# EAGLE design Tastendruckverlaengerer_1 (EAGLE 9.6.2)
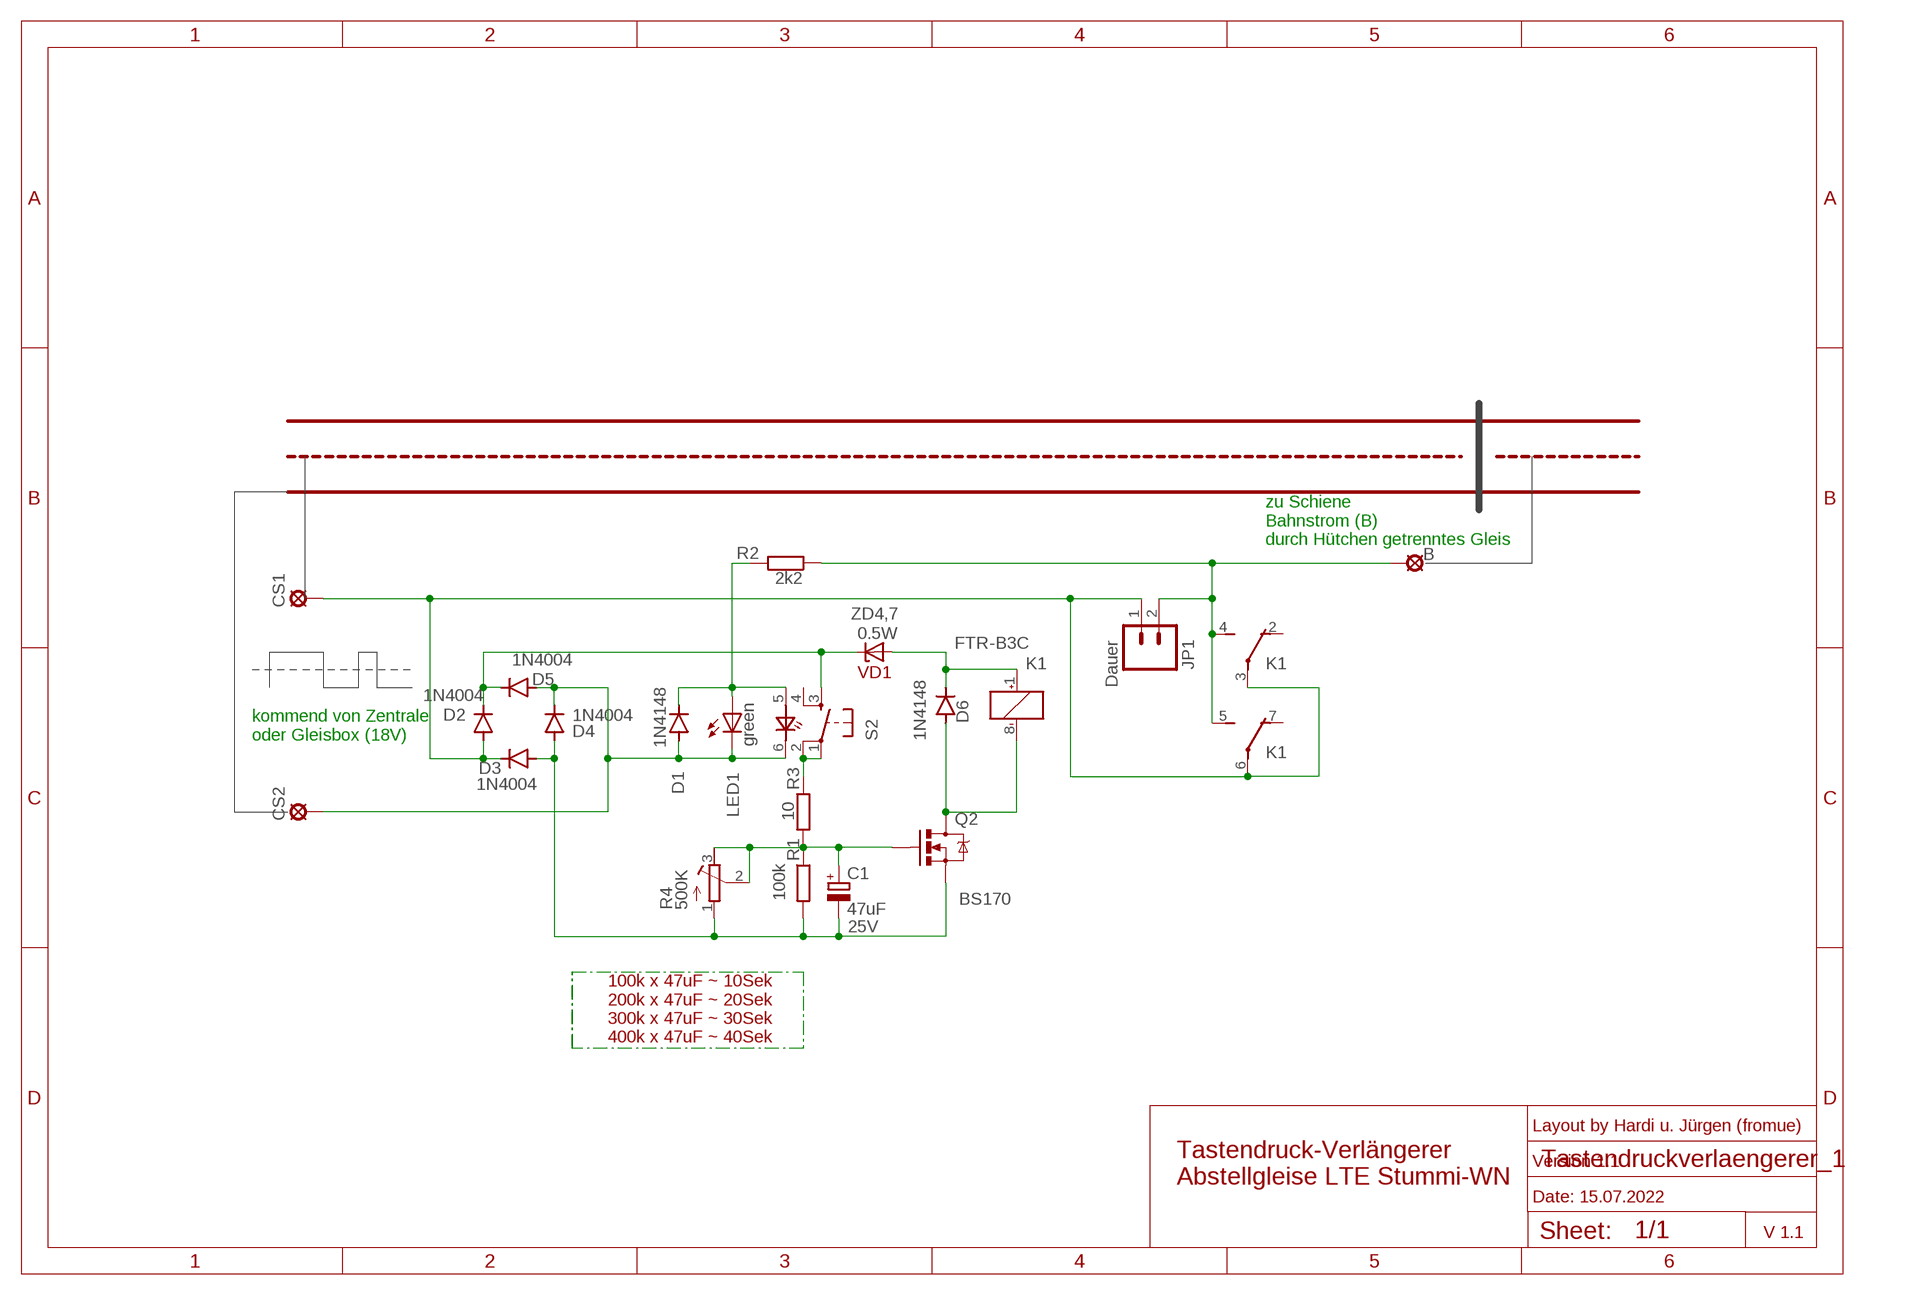
[diagram p0: schematic, sheet 1]

## Parts
B  SE14  [SE14]
C1  47uF  CPOL-EUTT2D5L  [TT2D5L]
CS1  SE14  [SE14]
CS2  SE14  [SE14]
D1  1N4148  1N4148DO35-7  [DO35-7]
D2  1N4004  1N4004DO41-10A  [DO41-10A]
D3  1N4004  1N4004DO41-10A  [DO41-10A]
D4  1N4004  1N4004DO41-10A  [DO41-10A]
D5  1N4004  1N4004DO41-10A  [DO41-10A]
D6  1N4148  1N4148DO35-7  [DO35-7]
JP1  Dauer  M02PTH  [1X02]
K1  FTR-B3C  [FTR-B4C]
LED1  green  LED3MM  [LED3MM]
Q2  BS170  MOSFET-NCHANNELBS170  [TO-92]
R1  100k  R0204/7  [0204/7]
R2  2k2  R0204/7  [0204/7]
R3  10  R0204/7  [0204/7]
R4  500K  R-TRIMM3296W  [RTRIM3296W]
S2  TASTER_LEDTC-1198-B  [TASTER_LED]
VD1  ZD4,7  DIODES-ZENER_5.6V(1N5232)  [DIODES-ZENER_DO35-7]

## Nets
N$3: CS1.MP D2.A D3.C JP1.1 K1.3(-1:P) K1.6(-2:P)
N$4: C1.- D3.A D4.A Q2.3(S) R1.2 R4.1(A)
N$5: D6.C K1.1(K:+) VD1.A
N$6: C1.+ Q2.2(G) R1.1 R3.2 R4.2(S) R4.3(E)
N$7: D6.A K1.8(K:-) Q2.1(D)
N$8: D1.C LED1.A R2.2 S2.5(+)
N$9: CS2.MP D1.A D4.C D5.A LED1.K(C) S2.6(-)
N$12: D2.C D5.C S2.3(S) VD1.C
N$13: B.MP JP1.2 K1.4(-1:S) K1.5(-2:S) R2.1
TAST: R3.1 S2.1(P) S2.2(P1)
Unconnected: K1.2(-1:O) K1.7(-2:O) S2.4(S1)

## Notes on the sheet
- zu Schiene 
  Bahnstrom (B)
  durch Hütchen getrenntes Gleis
- kommend von Zentrale
  oder Gleisbox (18V)
- 100k x 47uF ~ 10Sek
  200k x 47uF ~ 20Sek
  300k x 47uF ~ 30Sek
  400k x 47uF ~ 40Sek
- Layout by Hardi u. Jürgen (fromue)
- Version 1.1
- Tastendruck-Verlängerer
  Abstellgleise LTE Stummi-WN
- Date: 15.07.2022
- V 1.1

## Library data of the parts
B CS1 CS2 = solpad:SE14: SOLDER PAD E1553, drill 1,4mm, distributor Buerklin, 07F820
C1 = resistor:CPOL-EU: POLARIZED CAPACITOR, European symbol; ADD: 25V
D1 D6 = diode:1N4148: DIODE high speed (Philips); SPICEPREFIX: D
D2-D5 = diode:1N4004: DIODE general purpose rectifier, 1 A
JP1 = SparkFun-Connectors:M02: Standard 2-pin 0.1" header. Use with - straight break away headers ( PRT-00116) - right angle break away headers (PRT-00553) - swiss pins (PRT-00743) - machine pins (PRT-00117) - female headers (PRT-00115) Molex polarized connector foot print use with: PRT-08233 with associated crimp pins and housings. 2.54_SCREWTERM for use with PRT-10571. 3.5mm Screw Terminal footprints for PRT-08084 5mm Screw Terminal footprints for use with PRT-08432
K1 = relay:FTR-B3: ULTRA MINIATURE RELAY 2 POLES - 2 A (Slim Profile Signal Relay) FUJITSU FTR-B4 SERIES Source: FTR-B4.pdf
LED1 = Arduino_fuer_LEDs_DCC_2:LED: LED OSRAM: - CHIPLED LG R971, LG N971, LY N971, LG Q971, LY Q971, LO R971, LY R971 LH N974, LH R974 LS Q976, LO Q976, LY Q976 LO Q996 - Hyper CHIPLED LW Q18S LB Q993, LB Q99A, LB R99A - SideLED LS A670, LO A670, LY A670, LG A670, LP A670 LB A673, LV A673, LT A673, LW A673 LH A674 LY A675 LS A676, LA A676, LO A676, LY A676, LW A676 LS A679, LY A679, LG A679 - Hyper Micro SIDELED® LS Y876, LA Y876, LO Y876, LY Y876 LT Y87S - SmartLED LW L88C, LW L88S LB L89C, LB L89S, LG L890 LS L89K, LO L89K, LY L89K LS L896, LA L896, LO L896, LY L896 - TOPLED LS T670, LO T670, LY T670, LG T670, LP T670 LSG T670, LSP T670, LSY T670, LOP T670, LYG T670 LG T671, LOG T671, LSG T671 LB T673, LV T673, LT T673, LW T673 LH T674 LS T676, LA T676, LO T676, LY T676, LB T676, LH T676, LSB T676, LW T676 LB T67C, LV T67C, LT T67C, LS T67K, LO T67K, LY T67K, LW E67C LS E67B, LA E67B, LO E67B, LY E67B, LB E67C, LV E67C, LT E67C LW T67C LS T679, LY T679, LG T679 LS T770, LO T770, LY T770, LG T770, LP T770 LB T773, LV T773, LT T773, LW T773 LH T774 LS E675, LA E675, LY E675, LS T675 LS T776, LA T776, LO T776, LY T776, LB T776 LHGB T686 LT T68C, LB T68C - Hyper Mini TOPLED® LB M676 - Mini TOPLED Santana® LG M470 LS M47K, LO M47K, LY M47K Source: http://www.osram.convergy.de LUXEON: - LUMILED® LXK2-PW12-R00, LXK2-PW12-S00, LXK2-PW14-U00, LXK2-PW14-V00 LXK2-PM12-R00, LXK2-PM12-S00, LXK2-PM14-U00 LXK2-PE12-Q00, LXK2-PE12-R00, LXK2-PE12-S00, LXK2-PE14-T00, LXK2-PE14-U00 LXK2-PB12-K00, LXK2-PB12-L00, LXK2-PB12-M00, LXK2-PB14-N00, LXK2-PB14-P00, LXK2-PB14-Q00 LXK2-PR12-L00, LXK2-PR12-M00, LXK2-PR14-Q00, LXK2-PR14-R00 LXK2-PD12-Q00, LXK2-PD12-R00, LXK2-PD12-S00 LXK2-PH12-R00, LXK2-PH12-S00 LXK2-PL12-P00, LXK2-PL12-Q00, LXK2-PL12-R00 Source: www.luxeon.com KINGBRIGHT: KA-3528ASYC Source: www.kingbright.com
Q2 = SparkFun-DiscreteSemi:MOSFET-NCHANNEL: Common NMOSFET Parts MFG P/N Store ID Prod ID FDD8780 TRANS-09984 SI7820DN TRANS-11055 FDS6630A IC-08089 2N7002PW TRANS-11151 FQP30N06L COM-10213 TRANS-10060 BSS123LT1G TRANS-08345 BSS138 TRANS-00830 BS170 2N7000
R1 R3 = Arduino_fuer_LEDs_DCC_2:R: RESISTOR, European symbol; SPICEMODEL: NONE; SPICEPREFIX: R
R2 = Arduino_fuer_LEDs_DCC_2:R: RESISTOR, European symbol; SPICEMODEL: NONE; SPICEPREFIX: 4k7
R4 = resistor:R-TRIMM: Trimm resistor
S2 = switch-omron:TASTER_LED: OMRON SWITCH; ALI: https://de.aliexpress.com/item/4000415375387.html; ELV: 091576 EAN 4023392915765
VD1 = Z-Diode:DIODES-ZENER_?; MOUSER: ZF4.7; POWER: 0.5W

## Board
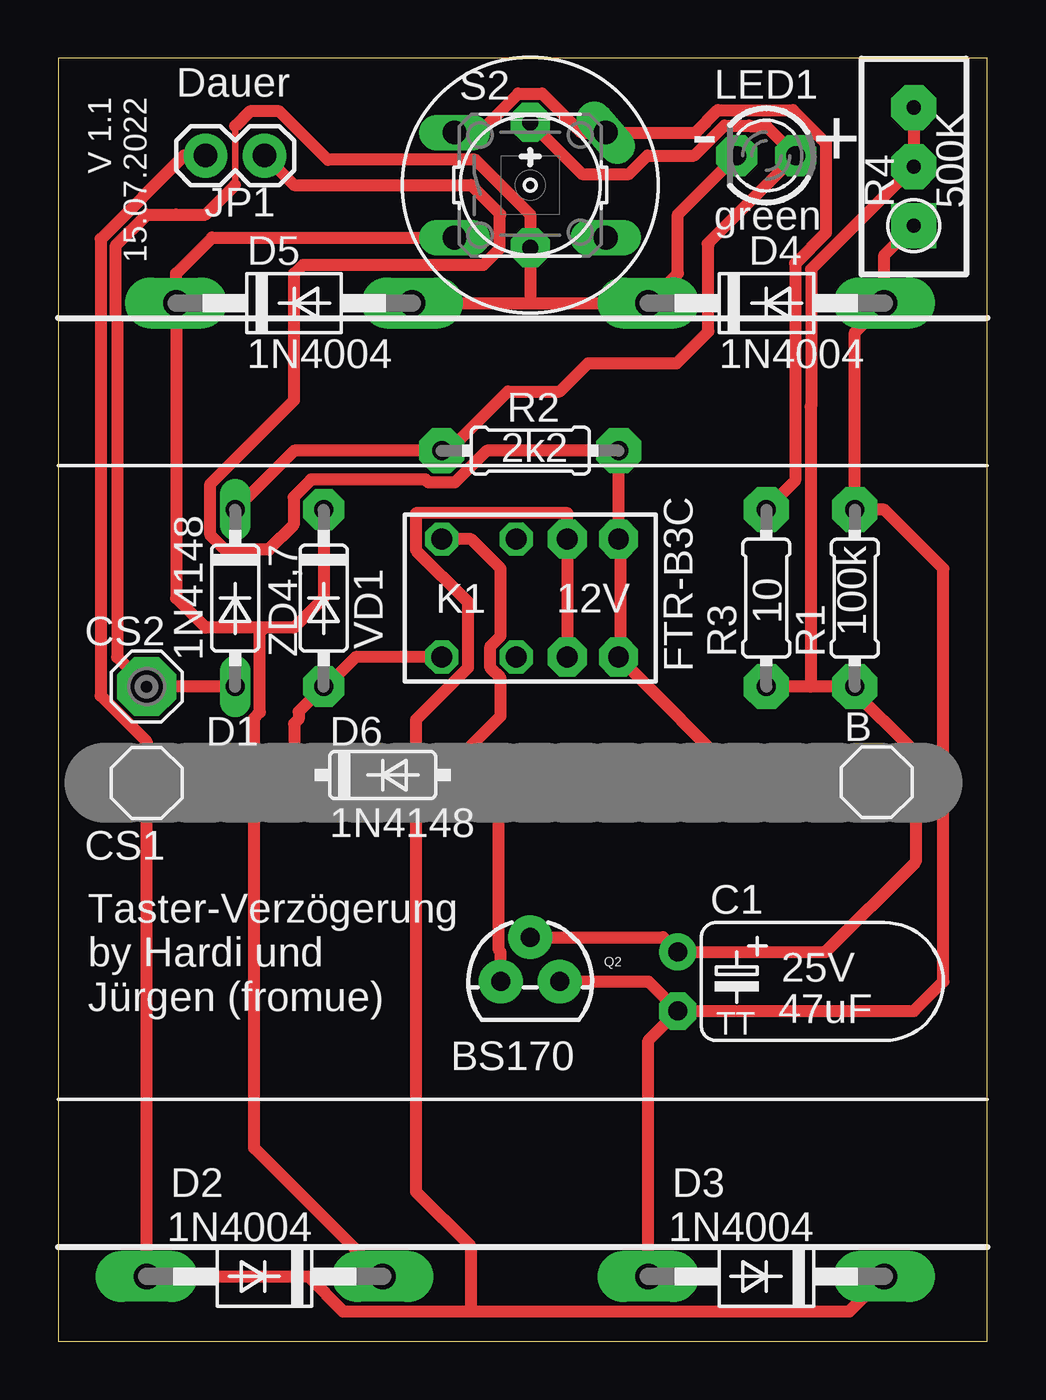
[diagram p1: board, top side]

Size 40 x 55.25 mm. Coordinates in mm from the lower left corner, seen from the top.
Outline: 0,0 40,0 40,55.25 0,55.25 0,0
Copper layers (1*16): Top 0.035mm / dielectric 1.5mm / Bottom 0.035mm
Design rules "default": minimum track width 6mil, minimum drill 0.35mm, track to track 6mil, track to pad 6mil, pad to pad 6mil, via to via 6mil, smd to smd 6mil, copper to edge 40mil, drill to drill 6mil, minimum pad ring 10mil, minimum via ring 8mil, stop-mask expansion 4mil, vias tented up to drill 0mil, thermal gap 10mil

### Footprints (pad centres in the part's own frame; a part is rotated, then mirrored left to right if it is on the bottom)
SE14 = drill 1.397 pad 2.54 octagon: MP 0,0
TT2D5L = drill 0.813 pad 1.6: + -1.27,0 | drill 0.813 pad 1.6 octagon: - 1.27,0
DO35-7 = drill 0.813 long: A 3.81,0; C -3.81,0
DO41-10A = drill 1.118 pad 2.184 long: A 5.08,0; C -5.08,0
1X02 = drill 1.016 pad 1.88: 1 0,0; 2 2.54,0
FTR-B4C = drill 0.9 pad 1.422 octagon: 1 -3.8,-2.54; 2 -0.6,-2.54; 7 -0.6,2.54; 8 -3.8,2.54 | drill 0.9 pad 1.676 octagon: 3 1.6,-2.54; 4 3.8,-2.54; 5 3.8,2.54; 6 1.6,2.54
LED3MM = drill 0.813 pad 1.778 octagon: A -1.27,0; K 1.27,0
TO-92 = drill 0.813 pad 1.88: 1 -1.27,0; 2 0,1.905; 3 1.27,0
0204/7 = drill 0.813 pad 1.93 octagon: 1 -3.81,0; 2 3.81,0
RTRIM3296W = drill 0.61 pad 1.93 square: 1 0,-2.54 | drill 0.61 pad 1.93 octagon: 2 0,0; 3 0,2.54
TASTER_LED = drill 1.016 long: 1 -3.251,2.261; 2 3.251,2.261; 3 -3.251,-2.261; 4 3.251,-2.261 | drill 0.7 pad 1.676 octagon: 5 0,2.7; 6 0,-2.7
DIODES-ZENER_DO35-7 = drill 0.813 pad 1.778 octagon: A 3.81,0; C -3.81,0

### Placement (x,y rotation side)
B  35.23,24.07 0 top
C1  26.67,15.49 270 top
CS1  3.81,24.04 0 top
CS2  3.81,28.19 0 top
D1  7.62,32 270 top
D2  8.89,2.79 180 top
D3  30.48,2.79 180 top
D4  30.48,44.7 0 top
D5  10.16,44.7 0 top
D6  13.97,24.38 0 top
JP1  6.35,51.05 0 top
K1  20.32,32 0 top
LED1  30.48,51.05 180 top
Q2  20.32,15.49 0 top
R1  34.29,32 90 top
R2  20.32,38.35 180 top
R3  30.48,32 270 top
R4  36.83,50.58 0 top
S2  20.32,49.78 0 top
VD1  11.43,32 270 top

### Tracks (layer width: path | path; a pad name or v marks a point on that pad's centre or on a via)
N$3
  Top 0.508: K1.3 K1.6 21.92,35.66 15.4,35.66 15.4,34.08 17.64,31.85 17.64,29 15.4,26.76 15.4,6.44 17.78,4.06 17.78,1.29 | JP1.1 5.42,51.05 1.83,47.47 1.83,27.8 3.81,25.82 CS1.MP D2.A 10.76,2.79 12.26,1.29 17.78,1.29 | 17.78,1.29 34.06,1.29 D3.C
N$4
  Top 0.508: Q2.3 25.4,15.49 C1.- | C1.- 36.83,14.22 38.1,15.49 38.1,33.27 35.56,35.81 R1.2 34.29,43.43 D4.A 35.56,46.77 R4.1 | C1.- 25.4,12.95 D3.A
N$5
  Top 0.152: 10.2,24.46 D6.C | 16.4,29.45 K1.1 | 11.6,28.25 VD1.A
  Top 0.2: 10.2,24.46 10.2,26.85 11.4,28.05 VD1.A | 16.4,29.45 12.8,29.45 11.6,28.25
  Top 0.508: K1.1 12.81,29.46 11.4,28.05 | VD1.A 10.35,27.12 10.35,26.79 10.16,26.6 D6.C
N$6
  Top 0.508: Q2.2 26.04,17.4 C1.+ 33.02,16.76 36.91,20.65 36.91,25.35 34.06,28.19 R1.1 32.38,28.19 | 32.38,28.19 R3.2 | R4.3 R4.2 32.41,46.16 32.41,40.26 32.38,40.23 32.38,28.19
N$7
  Top 0.152: 17.8,24.26 D6.A
  Top 0.508: D6.A 17.78,25.65 19.05,26.92 19.05,28.55 18.6,29 18.6,29.93 19.05,30.38 19.05,33.27 17.78,34.54 K1.8 | Q2.1 19.05,16.77 18.97,16.84 18.97,23.09 17.8,24.26
N$8
  Top 0.508: D1.C 10.16,38.35 R2.2 16.82,38.35 19.36,40.89 21.59,40.89 22.81,42.11 26.62,42.11 27.99,43.48 27.99,47.19 27.94,47.24 LED1.A 30.48,52.32 29.77,52.32 29.75,52.35 28.67,52.35 27.38,51.05 25.36,51.05 24.56,50.25 22.55,50.25 S2.5
N$9
  Top 0.279: 7.62,49.78 7.62,52.32
  Top 0.508: D1.A CS2.MP 2.54,29.46 2.54,44.03 2.49,44.08 2.49,47.19 3.81,48.51 5.08,48.51 6.35,48.51 7.62,49.78 | LED1.K 26.67,48.51 26.67,45.97 D4.C 20.32,44.7 | D5.A 20.32,44.7 | 20.32,44.7 S2.6 20.32,48.51 17.96,50.88 11.61,50.88 9.53,52.96 8.26,52.96 7.62,52.32
N$12
  Top 0.508: D2.C 8.43,8.33 8.43,25.65 8.43,25.8 8.43,26.84 8.69,27.09 8.69,30.53 8.89,30.73 | S2.3 6.63,47.52 5.08,45.97 D5.C 5.08,32 6.35,30.73 8.89,30.73 | 8.89,30.73 10.16,30.73 11.43,32 VD1.C
N$13
  Top 0.152: 24.2,29.65 K1.4
  Top 0.508: B.MP 29.52,24.07 K1.4 | 24.2,29.65 24.2,34.46 K1.5 R2.1 18.45,38.35 17.08,36.98 15.94,36.98 15.81,37.11 10.89,37.11 10.13,36.35 10.13,35.15 9.07,34.09 8.06,34.09 7.62,34.09 7.18,34.09 6.55,34.71 6.55,36.92 10.16,40.52 10.16,45.97 10.54,46.35 18.32,46.35 19,47.04 19,48.46 19.05,48.51 17.78,49.78 10.16,49.78 JP1.2
TAST
  Top 0.508: R3.1 31.73,37.06 31.73,46.41 33.05,47.73 33.05,51.59 31.63,53.01 28.4,53.01 27.43,52.04 S2.2 22.52,52.04 20.84,53.73 19.8,53.73 18.12,52.04 S2.1

### Text on the board
tNames: V 1.1 / 15.07.2022 | - | + | 12V | 25V | Taster-Verzögerung / by Hardi und / Jürgen (fromue)
bNames: Taster-Verzögerung / by Hardi und Jürgen (fromue) | V 1.1 / 15.07.2022
Document: Böschung | C-Gleis | Böschung